# EAGLE design untitled (EAGLE 5.11)
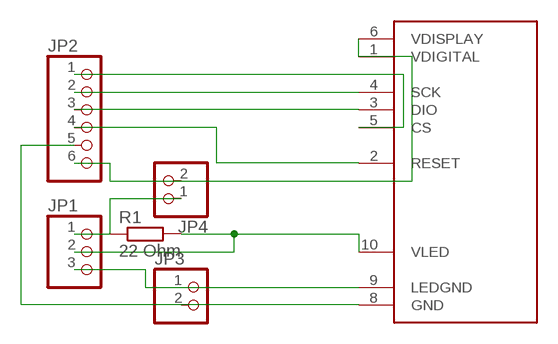
[diagram p0: schematic, sheet 1]

## Parts
JP1  PINHD-1X3/90  [1X03/90]
JP2  PINHD-1X6/90  [1X06/90]
JP3  PINHD-1X2/90  [1X02/90]
JP4  PINHD-1X2/90  [1X02/90]
R1  22 Ohm  R-EU_M3216  [M3216]
U$1  NOKIA6100_LCD  [NOKIA6100_LCD]

## Nets
N$1: JP1.1 JP4.1 R1.1
N$2: JP1.3 JP3.1 U$1.9(LEDGND)
N$3: JP1.2 R1.2 U$1.10(VLED)
N$4: JP2.5 JP3.2 U$1.8(GND)
N$5: JP2.6 JP4.2 U$1.1(VDIGITAL) U$1.6(VDISPLAY)
N$6: JP2.2 U$1.4(SCK)
N$7: JP2.4 U$1.2(RESET)
N$8: JP2.3 U$1.3(DIO)
N$9: JP2.1 U$1.5(CS)

## Library data of the parts
JP1 = pinhead:PINHD-1X3: PIN HEADER
JP2 = pinhead:PINHD-1X6: PIN HEADER
JP3 JP4 = pinhead:PINHD-1X2: PIN HEADER
R1 = resistor:R-EU_: RESISTOR, European symbol
U$1 = con-hirose-df23:NOKIA6100_LCD

## Board
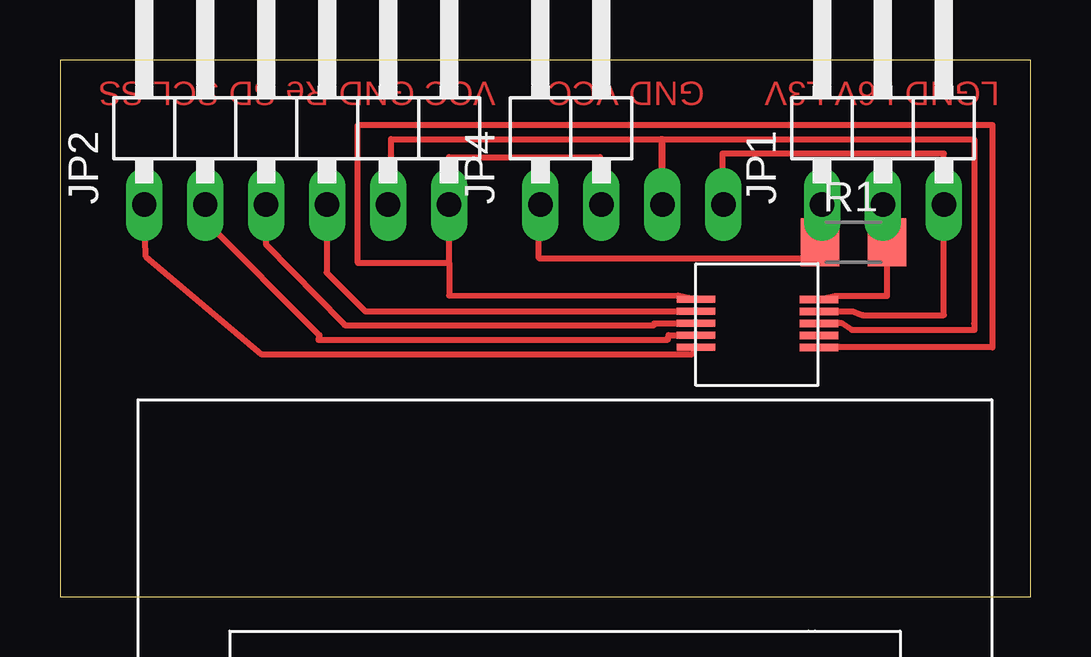
[diagram p1: board, top side]
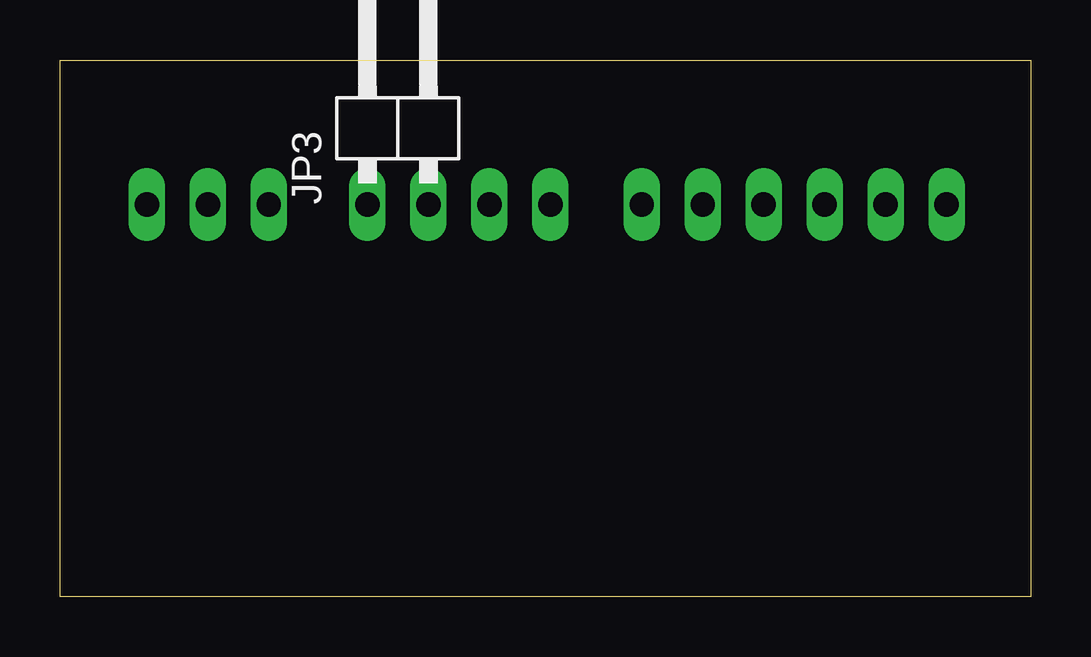
[diagram p2: board, bottom side, seen from below]

Size 40.45 x 22.37 mm. Coordinates in mm from the lower left corner, seen from the top.
Outline: 0,0 40.45,0 40.45,22.37 0,22.37 0,0
Copper layers (1*16): Top 0.035mm / dielectric 1.5mm / Bottom 0.035mm
Design rules "default": minimum track width 10mil, minimum drill 24mil, track to track 8mil, track to pad 8mil, pad to pad 8mil, via to via 8mil, smd to smd 8mil, copper to edge 40mil, drill to drill 8mil, minimum pad ring 10mil, minimum via ring 8mil, stop-mask expansion 4mil, vias tented up to drill 0mil, thermal gap 10mil

### Footprints (pad centres in the part's own frame; a part is rotated, then mirrored left to right if it is on the bottom)
1X03/90 = drill 1.016 long: 1 -2.54,-3.81; 2 0,-3.81; 3 2.54,-3.81
1X06/90 = drill 1.016 long: 1 -6.35,-3.81; 2 -3.81,-3.81; 3 -1.27,-3.81; 4 1.27,-3.81; 5 3.81,-3.81; 6 6.35,-3.81
1X02/90 = drill 1.016 long: 1 -1.27,-3.81; 2 1.27,-3.81
M3216 = smd 1.6 x 2: 1 -1.4,0; 2 1.4,0
NOKIA6100_LCD = smd 1.6 x 0.3: 1 24.255,44.311; 2 24.255,43.811; 3 24.255,43.311; 4 24.255,42.811; 5 24.255,42.311; 6 29.389,42.303; 7 29.389,42.803; 8 29.389,43.303; 9 29.389,43.803; 10 29.389,44.303

### Placement (x,y rotation side)
JP1  34.29,20.16 0 top
JP2  9.86,20.16 0 top
JP3  26.37,20.16 0 bottom
JP4  21.29,20.16 0 top
R1  33.06,14.78 0 top
U$1  2.24,-31.91 0 top

### Tracks (layer width: path | path; a pad name or v marks a point on that pad's centre or on a via)
N$1
  Top 0.254: JP1.1 31.45,16.35 31.45,15.08 R1.1 31.66,14.12 19.95,14.12 19.95,16.35 JP4.1
N$2
  Top 0.254: JP3.1 27.6,16.35 27.6,18.47 36.83,18.47 JP1.3 36.83,11.74 33.45,11.74 33.03,11.9 U$1.9
N$3
  Top 0.254: JP1.2 33.99,16.35 33.99,15.08 R1.2 34.46,12.54 32.3,12.54 U$1.10
N$4
  Top 0.254: JP2.5 13.8,16.35 13.8,19.07 25.05,19.07 | 25.05,19.07 25.1,19.07 | 25.1,19.07 JP3.2 25.05,16.35 25.05,19.07 | 25.1,19.07 38.09,19.07 38.09,11.4 38.1,11.12 33,11.12 32.57,11.41 U$1.8
N$5
  Top 0.254: JP4.2 22.5,16.35 22.5,18.32 16.21,18.32 JP2.6 16.21,13.92 | U$1.1 25.75,12.56 16.21,12.55 16.21,13.92 | U$1.6 38.85,10.39 38.85,19.67 12.41,19.67 12.41,13.92 16.21,13.92
N$6
  Top 0.254: U$1.4 26.49,10.91 25.36,10.91 25.33,10.72 10.77,10.71 10.81,10.91 6.05,15.67 JP2.2
N$7
  Top 0.254: JP2.4 11.13,13.55 11.1,13.52 12.72,11.9 U$1.2
N$8
  Top 0.254: U$1.3 26.44,11.4 24.76,11.4 24.76,11.32 11.86,11.32 11.81,11.4 8.59,14.68 JP2.3
N$9
  Top 0.254: U$1.5 26.34,10.11 8.38,10.11 3.58,14.18 JP2.1

### Text on the board
Top: VCC GND Re SD SCL SS | GND VCC | LGND L6V L3V